# EAGLE design k60 (EAGLE 9.6.2)
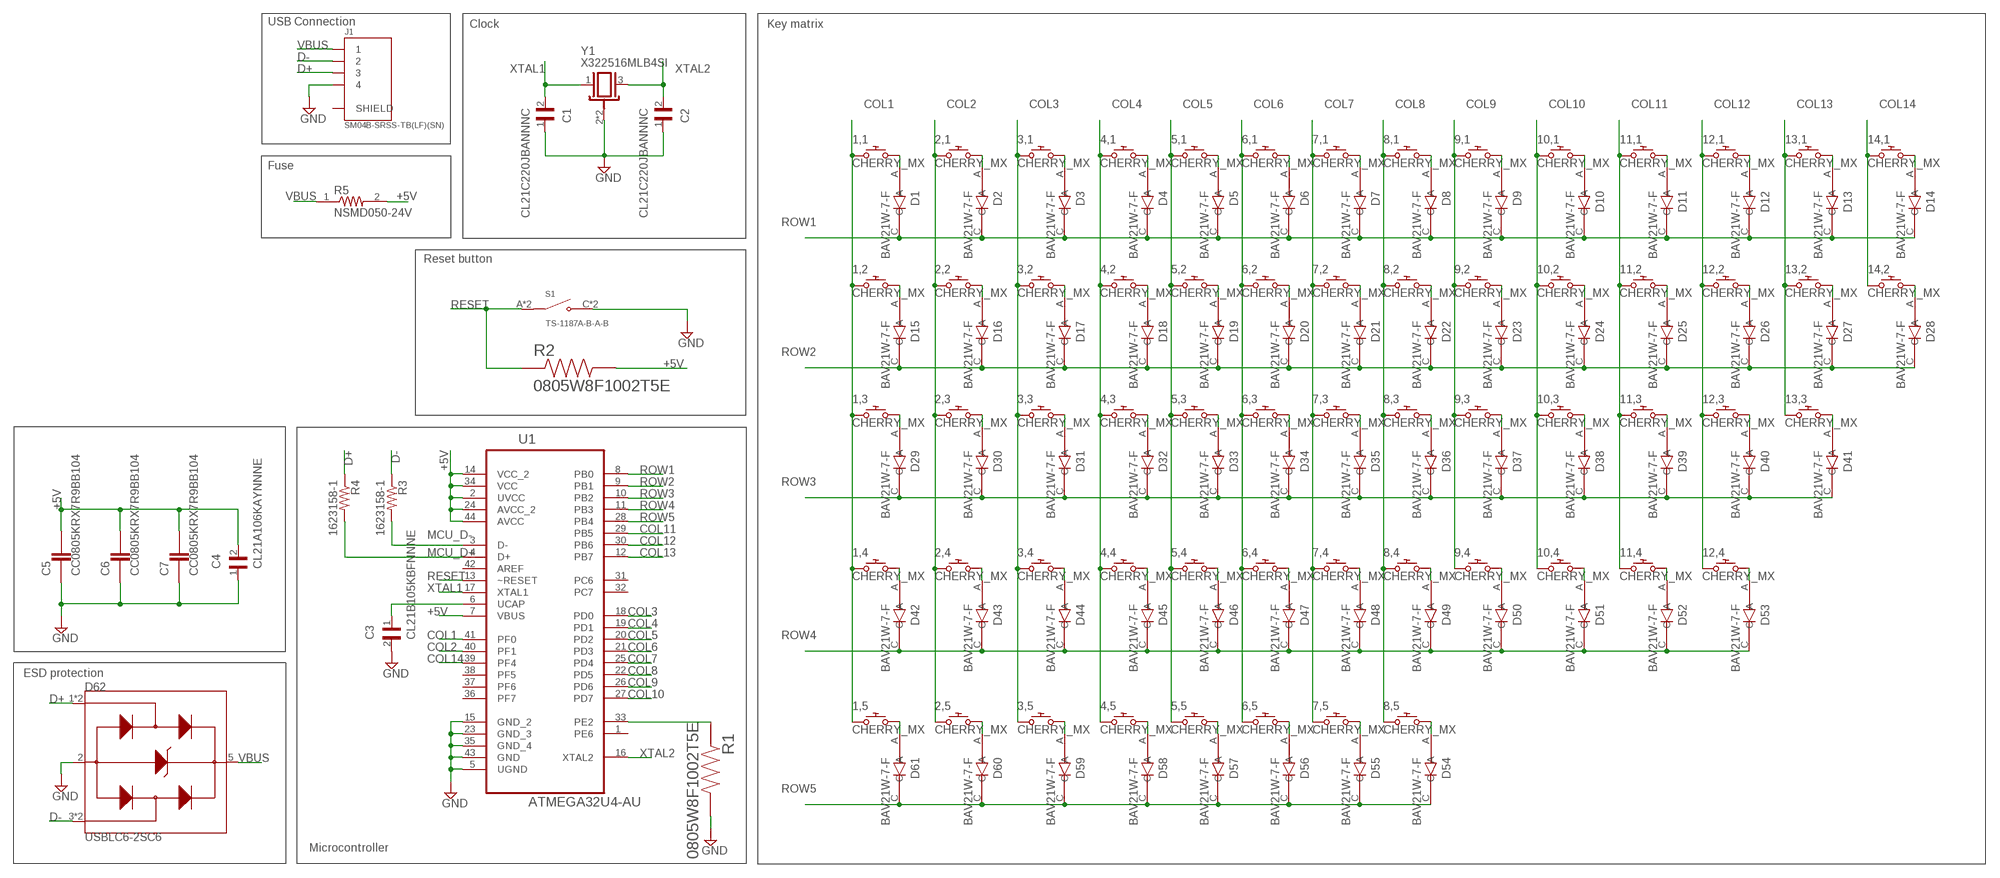
[diagram p0: schematic, sheet 1]

## Parts
1,1  CHERRY_MX  [CHERRY_MX]
1,2  CHERRY_MX  [CHERRY_MX]
1,3  CHERRY_MX  [CHERRY_MX]
1,4  CHERRY_MX  [CHERRY_MX]
1,5  CHERRY_MX  [CHERRY_MX]
2,1  CHERRY_MX  [CHERRY_MX]
2,2  CHERRY_MX  [CHERRY_MX]
2,3  CHERRY_MX  [CHERRY_MX]
2,4  CHERRY_MX  [CHERRY_MX]
2,5  CHERRY_MX  [CHERRY_MX]
3,1  CHERRY_MX  [CHERRY_MX]
3,2  CHERRY_MX  [CHERRY_MX]
3,3  CHERRY_MX  [CHERRY_MX]
3,4  CHERRY_MX  [CHERRY_MX]
3,5  CHERRY_MX  [CHERRY_MX]
4,1  CHERRY_MX  [CHERRY_MX]
4,2  CHERRY_MX  [CHERRY_MX]
4,3  CHERRY_MX  [CHERRY_MX]
4,4  CHERRY_MX  [CHERRY_MX]
4,5  CHERRY_MX  [CHERRY_MX]
5,1  CHERRY_MX  [CHERRY_MX]
5,2  CHERRY_MX  [CHERRY_MX]
5,3  CHERRY_MX  [CHERRY_MX]
5,4  CHERRY_MX  [CHERRY_MX]
5,5  CHERRY_MX  [CHERRY_MX]
6,1  CHERRY_MX  [CHERRY_MX]
6,2  CHERRY_MX  [CHERRY_MX]
6,3  CHERRY_MX  [CHERRY_MX]
6,4  CHERRY_MX  [CHERRY_MX]
6,5  CHERRY_MX  [CHERRY_MX]
7,1  CHERRY_MX  [CHERRY_MX]
7,2  CHERRY_MX  [CHERRY_MX]
7,3  CHERRY_MX  [CHERRY_MX]
7,4  CHERRY_MX  [CHERRY_MX]
7,5  CHERRY_MX  [CHERRY_MX]
8,1  CHERRY_MX  [CHERRY_MX]
8,2  CHERRY_MX  [CHERRY_MX]
8,3  CHERRY_MX  [CHERRY_MX]
8,4  CHERRY_MX  [CHERRY_MX]
8,5  CHERRY_MX  [CHERRY_MX]
9,1  CHERRY_MX  [CHERRY_MX]
9,2  CHERRY_MX  [CHERRY_MX]
9,3  CHERRY_MX  [CHERRY_MX]
9,4  CHERRY_MX  [CHERRY_MX]
10,1  CHERRY_MX  [CHERRY_MX]
10,2  CHERRY_MX  [CHERRY_MX]
10,3  CHERRY_MX  [CHERRY_MX]
10,4  CHERRY_MX  [CHERRY_MX]
11,1  CHERRY_MX  [CHERRY_MX]
11,2  CHERRY_MX  [CHERRY_MX]
11,3  CHERRY_MX  [CHERRY_MX]
11,4  CHERRY_MX  [CHERRY_MX]
12,1  CHERRY_MX  [CHERRY_MX]
12,2  CHERRY_MX  [CHERRY_MX]
12,3  CHERRY_MX  [CHERRY_MX]
12,4  CHERRY_MX  [CHERRY_MX]
13,1  CHERRY_MX  [CHERRY_MX]
13,2  CHERRY_MX  [CHERRY_MX]
13,3  CHERRY_MX  [CHERRY_MX]
14,1  CHERRY_MX  [CHERRY_MX]
14,2  CHERRY_MX  [CHERRY_MX]
C1  CL21C220JBANNNC  [CAPC2012X140N]
C2  CL21C220JBANNNC  [CAPC2012X140N]
C3  CL21B105KBFNNNE  [CL21B105KBFNNNE_CAPC2012X140N]
C4  CL21A106KAYNNNE  [CAPC2012X135N]
C5  CC0805KRX7R9BB104  [CAPC2012X70]
C6  CC0805KRX7R9BB104  [CAPC2012X70]
C7  CC0805KRX7R9BB104  [CAPC2012X70]
D1  BAV21W-7-F  [SOD3715X135N]
D2  BAV21W-7-F  [SOD3715X135N]
D3  BAV21W-7-F  [SOD3715X135N]
D4  BAV21W-7-F  [SOD3715X135N]
D5  BAV21W-7-F  [SOD3715X135N]
D6  BAV21W-7-F  [SOD3715X135N]
D7  BAV21W-7-F  [SOD3715X135N]
D8  BAV21W-7-F  [SOD3715X135N]
D9  BAV21W-7-F  [SOD3715X135N]
D10  BAV21W-7-F  [SOD3715X135N]
D11  BAV21W-7-F  [SOD3715X135N]
D12  BAV21W-7-F  [SOD3715X135N]
D13  BAV21W-7-F  [SOD3715X135N]
D14  BAV21W-7-F  [SOD3715X135N]
D15  BAV21W-7-F  [SOD3715X135N]
D16  BAV21W-7-F  [SOD3715X135N]
D17  BAV21W-7-F  [SOD3715X135N]
D18  BAV21W-7-F  [SOD3715X135N]
D19  BAV21W-7-F  [SOD3715X135N]
D20  BAV21W-7-F  [SOD3715X135N]
D21  BAV21W-7-F  [SOD3715X135N]
D22  BAV21W-7-F  [SOD3715X135N]
D23  BAV21W-7-F  [SOD3715X135N]
D24  BAV21W-7-F  [SOD3715X135N]
D25  BAV21W-7-F  [SOD3715X135N]
D26  BAV21W-7-F  [SOD3715X135N]
D27  BAV21W-7-F  [SOD3715X135N]
D28  BAV21W-7-F  [SOD3715X135N]
D29  BAV21W-7-F  [SOD3715X135N]
D30  BAV21W-7-F  [SOD3715X135N]
D31  BAV21W-7-F  [SOD3715X135N]
D32  BAV21W-7-F  [SOD3715X135N]
D33  BAV21W-7-F  [SOD3715X135N]
D34  BAV21W-7-F  [SOD3715X135N]
D35  BAV21W-7-F  [SOD3715X135N]
D36  BAV21W-7-F  [SOD3715X135N]
D37  BAV21W-7-F  [SOD3715X135N]
D38  BAV21W-7-F  [SOD3715X135N]
D39  BAV21W-7-F  [SOD3715X135N]
D40  BAV21W-7-F  [SOD3715X135N]
D41  BAV21W-7-F  [SOD3715X135N]
D42  BAV21W-7-F  [SOD3715X135N]
D43  BAV21W-7-F  [SOD3715X135N]
D44  BAV21W-7-F  [SOD3715X135N]
D45  BAV21W-7-F  [SOD3715X135N]
D46  BAV21W-7-F  [SOD3715X135N]
D47  BAV21W-7-F  [SOD3715X135N]
D48  BAV21W-7-F  [SOD3715X135N]
D49  BAV21W-7-F  [SOD3715X135N]
D50  BAV21W-7-F  [SOD3715X135N]
D51  BAV21W-7-F  [SOD3715X135N]
D52  BAV21W-7-F  [SOD3715X135N]
D53  BAV21W-7-F  [SOD3715X135N]
D54  BAV21W-7-F  [SOD3715X135N]
D55  BAV21W-7-F  [SOD3715X135N]
D56  BAV21W-7-F  [SOD3715X135N]
D57  BAV21W-7-F  [SOD3715X135N]
D58  BAV21W-7-F  [SOD3715X135N]
D59  BAV21W-7-F  [SOD3715X135N]
D60  BAV21W-7-F  [SOD3715X135N]
D61  BAV21W-7-F  [SOD3715X135N]
D62  USBLC6-2SC6  [SOT95P280X145-6N]
J1  SM04B-SRSS-TB(LF)(SN)  [JST_SM04B-SRSS-TB(LF)(SN)]
R1  0805W8F1002T5E  [RESC2012X60N]
R2  0805W8F1002T5E  [RESC2012X60N]
R3  1623158-1  [RESC2012X65N]
R4  1623158-1  [RESC2012X65N]
R5  NSMD050-24V  [RESC3115X65N]
S1  TS-1187A-B-A-B  [SW_TS-1187A-B-A-B]
U1  ATMEGA32U4-AU  [QFP80P1200X1200X120-44N]
Y1  X322516MLB4SI  [OSC_X322516MLB4SI]

## Nets
+5V: C4.2 C5.2 C6.2 C7.2 R2.2 R5.2 U1.2(UVCC) U1.7(VBUS) U1.14(VCC_2) U1.24(AVCC_2) U1.34(VCC) U1.44(AVCC)
COL1: 1,1.S1 1,2.S1 1,3.S1 1,4.S1 1,5.S1 U1.41(PF0)
COL2: 2,1.S1 2,2.S1 2,3.S1 2,4.S1 2,5.S1 U1.40(PF1)
COL3: 3,1.S1 3,2.S1 3,3.S1 3,4.S1 3,5.S1 U1.18(PD0)
COL4: 4,1.S1 4,2.S1 4,3.S1 4,4.S1 4,5.S1 U1.19(PD1)
COL5: 5,1.S1 5,2.S1 5,3.S1 5,4.S1 5,5.S1 U1.20(PD2)
COL6: 6,1.S1 6,2.S1 6,3.S1 6,4.S1 6,5.S1 U1.21(PD3)
COL7: 7,1.S1 7,2.S1 7,3.S1 7,4.S1 7,5.S1 U1.25(PD4)
COL8: 8,1.S1 8,2.S1 8,3.S1 8,4.S1 8,5.S1 U1.22(PD5)
COL9: 9,1.S1 9,2.S1 9,3.S1 9,4.S1 U1.26(PD6)
COL10: 10,1.S1 10,2.S1 10,3.S1 10,4.S1 U1.27(PD7)
COL11: 11,1.S1 11,2.S1 11,3.S1 11,4.S1 U1.29(PB5)
COL12: 12,1.S1 12,2.S1 12,3.S1 12,4.S1 U1.30(PB6)
COL13: 13,1.S1 13,2.S1 13,3.S1 U1.12(PB7)
COL14: 14,1.S1 14,2.S1 U1.39(PF4)
D+: D62.1(I/O1) D62.6(I/O1) J1.3 R4.1
D-: D62.3(I/O2) D62.4(I/O2) J1.2 R3.1
GND: C1.1 C2.1 C3.2 C4.1 C5.1 C6.1 C7.1 D62.2(GND) J1.4 R1.2 S1.C(NO) S1.D(NO) U1.5(UGND) U1.15(GND_2) U1.23(GND_3) U1.35(GND_4) U1.43(GND) Y1.2(GND) Y1.4(GND)
MCU_D+: R4.2 U1.4(D+)
MCU_D-: R3.2 U1.3(D-)
N$3: C3.1 U1.6(UCAP)
N$4: R1.1 U1.33(PE2)
N$15: 1,1.S2 D1.A
N$16: 2,1.S2 D2.A
N$17: 3,1.S2 D3.A
N$18: 4,1.S2 D4.A
N$19: 5,1.S2 D5.A
N$20: 6,1.S2 D6.A
N$21: 7,1.S2 D7.A
N$22: 8,1.S2 D8.A
N$23: 9,1.S2 D9.A
N$24: 10,1.S2 D10.A
N$25: 11,1.S2 D11.A
N$26: 12,1.S2 D12.A
N$27: 13,1.S2 D13.A
N$28: 14,1.S2 D14.A
N$29: 1,2.S2 D15.A
N$30: 2,2.S2 D16.A
N$31: 3,2.S2 D17.A
N$32: 4,2.S2 D18.A
N$33: 5,2.S2 D19.A
N$34: 6,2.S2 D20.A
N$35: 7,2.S2 D21.A
N$36: 8,2.S2 D22.A
N$37: 9,2.S2 D23.A
N$38: 10,2.S2 D24.A
N$39: 11,2.S2 D25.A
N$40: 12,2.S2 D26.A
N$41: 13,2.S2 D27.A
N$42: 1,3.S2 D29.A
N$43: 2,3.S2 D30.A
N$44: 3,3.S2 D31.A
N$45: 4,3.S2 D32.A
N$46: 5,3.S2 D33.A
N$47: 6,3.S2 D34.A
N$48: 7,3.S2 D35.A
N$49: 8,3.S2 D36.A
N$50: 9,3.S2 D37.A
N$51: 10,3.S2 D38.A
N$52: 11,3.S2 D39.A
N$53: 12,3.S2 D40.A
N$54: 13,3.S2 D41.A
N$55: 14,2.S2 D28.A
N$56: 1,4.S2 D42.A
N$57: 2,4.S2 D43.A
N$58: 3,4.S2 D44.A
N$59: 4,4.S2 D45.A
N$60: 5,4.S2 D46.A
N$61: 6,4.S2 D47.A
N$62: 7,4.S2 D48.A
N$63: 8,4.S2 D49.A
N$64: 9,4.S2 D50.A
N$65: 10,4.S2 D51.A
N$66: 11,4.S2 D52.A
N$67: 12,4.S2 D53.A
N$69: 1,5.S2 D61.A
N$70: 2,5.S2 D60.A
N$71: 3,5.S2 D59.A
N$72: 4,5.S2 D58.A
N$73: 5,5.S2 D57.A
N$74: 6,5.S2 D56.A
N$75: 7,5.S2 D55.A
N$76: 8,5.S2 D54.A
RESET: R2.1 S1.A(COM) S1.B(COM) U1.13(~RESET)
ROW1: D1.C D2.C D3.C D4.C D5.C D6.C D7.C D8.C D9.C D10.C D11.C D12.C D13.C D14.C U1.8(PB0)
ROW2: D15.C D16.C D17.C D18.C D19.C D20.C D21.C D22.C D23.C D24.C D25.C D26.C D27.C D28.C U1.9(PB1)
ROW3: D29.C D30.C D31.C D32.C D33.C D34.C D35.C D36.C D37.C D38.C D39.C D40.C D41.C U1.10(PB2)
ROW4: D42.C D43.C D44.C D45.C D46.C D47.C D48.C D49.C D50.C D51.C D52.C D53.C U1.11(PB3)
ROW5: D54.C D55.C D56.C D57.C D58.C D59.C D60.C D61.C U1.28(PB4)
VBUS: D62.5(VBUS) J1.1 R5.1
XTAL1: C1.2 U1.17(XTAL1) Y1.1
XTAL2: C2.2 U1.16(XTAL2) Y1.3
Unconnected: J1.S1(SHIELD) J1.S2(SHIELD) U1.1(PE6) U1.31(PC6) U1.32(PC7) U1.36(PF7) U1.37(PF6) U1.38(PF5) U1.42(AREF)

## Notes on the sheet
- USB Connection | Clock | Key matrix
- Fuse
- Reset button
- ESD protection
- Microcontroller

## Library data of the parts
1,1-1,5 2,1-2,5 3,1-3,5 4,1-4,5 5,1-5,5 6,1-6,5 7,1-7,5 8,1-8,5 9,1-9,4 10,1-10,4 11,1-11,4 12,1-12,4 13,1-13,3 14,1 14,2 = cherry:CHERRY_MX: Cherry keymodule MX; FARNELL: 2292961; MOUSER: 540-MX1A-11NW
C1 C2 = k60:CL21C220JBANNNC: KC 22pF 0805 5% 50V NP0; LCSC_PART#: C1804
C3 = k60:CL21B105KBFNNNE: Capacitor: ceramic; MLCC; 1uF; 50V; X7R; ±10%; SMD; 0805; LCSC_PART#: C28323
C4 = k60:CL21A106KAYNNNE: Cap Ceramic 10uF 25V X5R 10% SMD 0805 85°C Embossed T/R; LCSC_PART#: C15850
C5-C7 = k60:CC0805KRX7R9BB104: 0805 0.1 uF 50 V ±10 % Tolerance X7R SMT Multilayer Ceramic Capacitor; LCSC_PART#: C49678; MANUFACTURER: YAGEO
D1-D61 = k60:BAV21W-7-F: SURFACE MOUNT SWITCHING DIODE; LCSC_PART#: C81598; MANUFACTURER: Diodes Inc.
D62 = k60:USBLC6-2SC6: 17V Clamp 5A (8/20µs) Ipp Tvs Diode Surface Mount SOT-23-6; MANUFACTURER: STMicroelectronics; MAXIMUM_PACKAGE_HEIGHT: 1.45mm; PARTREV: 5; STANDARD: IPC-7351B
J1 = k60:SM04B-SRSS-TB(LF)(SN): SH Series 1.0 mm Pitch 2 Position Single Row Side Entry Shrouded Header; LCSC_PART#: C160404; MANUFACTURER: JST; STANDARD: Manufacturer recommendations
R1 R2 = k60:0805W8F1002T5E: Chip Resistor - Surface Mount 10KOhms ±1% 1/8W 0805 RoHS; LCSC_PART#: C17414
R3 R4 = k60:1623158-1: CRG0805 1% 22R; LCSC_PART#: C17561
R5 = k60:NSMD050-24V: PTC Resettable Fuses 1206 RoHS; LCSC_PART#: C70076
S1 = k60:TS-1187A-B-A-B: SPST 50mA @ 12VDC Top Actuated Round Button 160gf SMD Tactile Switches RoHS; LCSC_PART#: C318884; MANUFACTURER: XKB Industrial Precision; MAXIMUM_PACKAGE_HEIGHT: 1.5mm; PARTREV: A0; STANDARD: Manufacturer Recommendations
U1 = k60:ATMEGA32U4-AU: 8-bit Microcontroller with ISP Flash and USB Controller; LCSC_PART#: C44854; MPN: ATMEGA32U4-AU; OC_FARNELL: 1748525; OC_NEWARK: 26R5633; PACKAGE: TQFP-44; SUPPLIER: Atmel
Y1 = k60:X322516MLB4SI: External dimensions: 3.2 x 2.5 x 0.8 mm. Frequency range: 11.0592MHz ~54MHz; LCSC_PART#: C13738; MANUFACTURER: YXC; MAXIMUM_PACKAGE_HEIGHT: 0.8 mm; PARTREV: N/A; STANDARD: Manufacturer Recommendations

## Module MATRIX
Ports: N$1(io) N$2(io) N$3(io) N$4(io) N$5(io) ROW1(io) ROW2(io) ROW3(io) ROW4(io) ROW5(io)
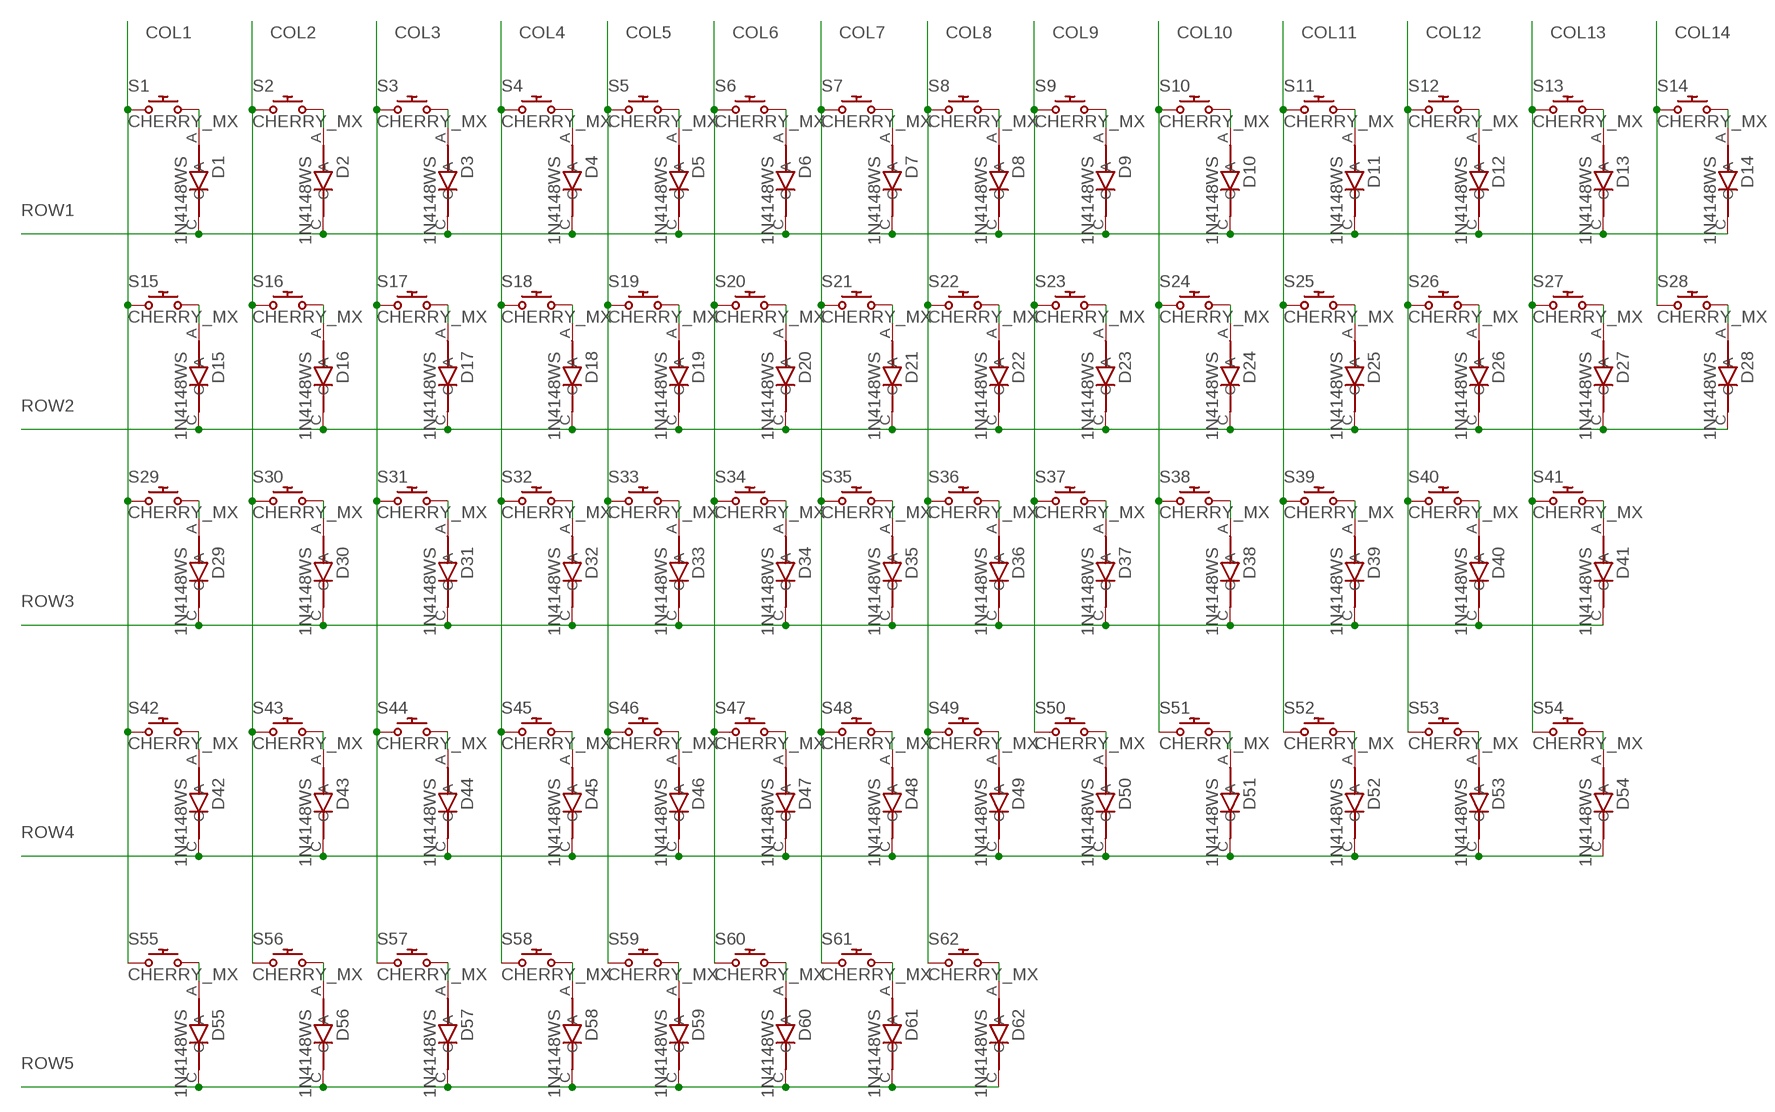
[diagram p1: schematic, module MATRIX, sheet 1]

### Parts
D1  1N4148WS  [SODFL2512X100N]
D2  1N4148WS  [SODFL2512X100N]
D3  1N4148WS  [SODFL2512X100N]
D4  1N4148WS  [SODFL2512X100N]
D5  1N4148WS  [SODFL2512X100N]
D6  1N4148WS  [SODFL2512X100N]
D7  1N4148WS  [SODFL2512X100N]
D8  1N4148WS  [SODFL2512X100N]
D9  1N4148WS  [SODFL2512X100N]
D10  1N4148WS  [SODFL2512X100N]
D11  1N4148WS  [SODFL2512X100N]
D12  1N4148WS  [SODFL2512X100N]
D13  1N4148WS  [SODFL2512X100N]
D14  1N4148WS  [SODFL2512X100N]
D15  1N4148WS  [SODFL2512X100N]
D16  1N4148WS  [SODFL2512X100N]
D17  1N4148WS  [SODFL2512X100N]
D18  1N4148WS  [SODFL2512X100N]
D19  1N4148WS  [SODFL2512X100N]
D20  1N4148WS  [SODFL2512X100N]
D21  1N4148WS  [SODFL2512X100N]
D22  1N4148WS  [SODFL2512X100N]
D23  1N4148WS  [SODFL2512X100N]
D24  1N4148WS  [SODFL2512X100N]
D25  1N4148WS  [SODFL2512X100N]
D26  1N4148WS  [SODFL2512X100N]
D27  1N4148WS  [SODFL2512X100N]
D28  1N4148WS  [SODFL2512X100N]
D29  1N4148WS  [SODFL2512X100N]
D30  1N4148WS  [SODFL2512X100N]
D31  1N4148WS  [SODFL2512X100N]
D32  1N4148WS  [SODFL2512X100N]
D33  1N4148WS  [SODFL2512X100N]
D34  1N4148WS  [SODFL2512X100N]
D35  1N4148WS  [SODFL2512X100N]
D36  1N4148WS  [SODFL2512X100N]
D37  1N4148WS  [SODFL2512X100N]
D38  1N4148WS  [SODFL2512X100N]
D39  1N4148WS  [SODFL2512X100N]
D40  1N4148WS  [SODFL2512X100N]
D41  1N4148WS  [SODFL2512X100N]
D42  1N4148WS  [SODFL2512X100N]
D43  1N4148WS  [SODFL2512X100N]
D44  1N4148WS  [SODFL2512X100N]
D45  1N4148WS  [SODFL2512X100N]
D46  1N4148WS  [SODFL2512X100N]
D47  1N4148WS  [SODFL2512X100N]
D48  1N4148WS  [SODFL2512X100N]
D49  1N4148WS  [SODFL2512X100N]
D50  1N4148WS  [SODFL2512X100N]
D51  1N4148WS  [SODFL2512X100N]
D52  1N4148WS  [SODFL2512X100N]
D53  1N4148WS  [SODFL2512X100N]
D54  1N4148WS  [SODFL2512X100N]
D55  1N4148WS  [SODFL2512X100N]
D56  1N4148WS  [SODFL2512X100N]
D57  1N4148WS  [SODFL2512X100N]
D58  1N4148WS  [SODFL2512X100N]
D59  1N4148WS  [SODFL2512X100N]
D60  1N4148WS  [SODFL2512X100N]
D61  1N4148WS  [SODFL2512X100N]
D62  1N4148WS  [SODFL2512X100N]
S1  CHERRY_MX  [CHERRY_MX]
S2  CHERRY_MX  [CHERRY_MX]
S3  CHERRY_MX  [CHERRY_MX]
S4  CHERRY_MX  [CHERRY_MX]
S5  CHERRY_MX  [CHERRY_MX]
S6  CHERRY_MX  [CHERRY_MX]
S7  CHERRY_MX  [CHERRY_MX]
S8  CHERRY_MX  [CHERRY_MX]
S9  CHERRY_MX  [CHERRY_MX]
S10  CHERRY_MX  [CHERRY_MX]
S11  CHERRY_MX  [CHERRY_MX]
S12  CHERRY_MX  [CHERRY_MX]
S13  CHERRY_MX  [CHERRY_MX]
S14  CHERRY_MX  [CHERRY_MX]
S15  CHERRY_MX  [CHERRY_MX]
S16  CHERRY_MX  [CHERRY_MX]
S17  CHERRY_MX  [CHERRY_MX]
S18  CHERRY_MX  [CHERRY_MX]
S19  CHERRY_MX  [CHERRY_MX]
S20  CHERRY_MX  [CHERRY_MX]
S21  CHERRY_MX  [CHERRY_MX]
S22  CHERRY_MX  [CHERRY_MX]
S23  CHERRY_MX  [CHERRY_MX]
S24  CHERRY_MX  [CHERRY_MX]
S25  CHERRY_MX  [CHERRY_MX]
S26  CHERRY_MX  [CHERRY_MX]
S27  CHERRY_MX  [CHERRY_MX]
S28  CHERRY_MX  [CHERRY_MX]
S29  CHERRY_MX  [CHERRY_MX]
S30  CHERRY_MX  [CHERRY_MX]
S31  CHERRY_MX  [CHERRY_MX]
S32  CHERRY_MX  [CHERRY_MX]
S33  CHERRY_MX  [CHERRY_MX]
S34  CHERRY_MX  [CHERRY_MX]
S35  CHERRY_MX  [CHERRY_MX]
S36  CHERRY_MX  [CHERRY_MX]
S37  CHERRY_MX  [CHERRY_MX]
S38  CHERRY_MX  [CHERRY_MX]
S39  CHERRY_MX  [CHERRY_MX]
S40  CHERRY_MX  [CHERRY_MX]
S41  CHERRY_MX  [CHERRY_MX]
S42  CHERRY_MX  [CHERRY_MX]
S43  CHERRY_MX  [CHERRY_MX]
S44  CHERRY_MX  [CHERRY_MX]
S45  CHERRY_MX  [CHERRY_MX]
S46  CHERRY_MX  [CHERRY_MX]
S47  CHERRY_MX  [CHERRY_MX]
S48  CHERRY_MX  [CHERRY_MX]
S49  CHERRY_MX  [CHERRY_MX]
S50  CHERRY_MX  [CHERRY_MX]
S51  CHERRY_MX  [CHERRY_MX]
S52  CHERRY_MX  [CHERRY_MX]
S53  CHERRY_MX  [CHERRY_MX]
S54  CHERRY_MX  [CHERRY_MX]
S55  CHERRY_MX  [CHERRY_MX]
S56  CHERRY_MX  [CHERRY_MX]
S57  CHERRY_MX  [CHERRY_MX]
S58  CHERRY_MX  [CHERRY_MX]
S59  CHERRY_MX  [CHERRY_MX]
S60  CHERRY_MX  [CHERRY_MX]
S61  CHERRY_MX  [CHERRY_MX]
S62  CHERRY_MX  [CHERRY_MX]

### Nets
COL1: S1.S1 S15.S1 S29.S1 S42.S1 S55.S1
COL2: S2.S1 S16.S1 S30.S1 S43.S1 S56.S1
COL3: S3.S1 S17.S1 S31.S1 S44.S1 S57.S1
COL4: S4.S1 S18.S1 S32.S1 S45.S1 S58.S1
COL5: S5.S1 S19.S1 S33.S1 S46.S1 S59.S1
COL6: S6.S1 S20.S1 S34.S1 S47.S1 S60.S1
COL7: S7.S1 S21.S1 S35.S1 S48.S1 S61.S1
COL8: S8.S1 S22.S1 S36.S1 S49.S1 S62.S1
COL9: S9.S1 S23.S1 S37.S1 S50.S1
COL10: S10.S1 S24.S1 S38.S1 S51.S1
COL11: S11.S1 S25.S1 S39.S1 S52.S1
COL12: S12.S1 S26.S1 S40.S1 S53.S1
COL13: S13.S1 S27.S1 S41.S1 S54.S1
COL14: S14.S1 S28.S1
N$15: D1.A S1.S2
N$16: D2.A S2.S2
N$17: D3.A S3.S2
N$18: D4.A S4.S2
N$19: D5.A S5.S2
N$20: D6.A S6.S2
N$21: D7.A S7.S2
N$22: D8.A S8.S2
N$23: D9.A S9.S2
N$24: D10.A S10.S2
N$25: D11.A S11.S2
N$26: D12.A S12.S2
N$27: D13.A S13.S2
N$28: D14.A S14.S2
N$29: D15.A S15.S2
N$30: D16.A S16.S2
N$31: D17.A S17.S2
N$32: D18.A S18.S2
N$33: D19.A S19.S2
N$34: D20.A S20.S2
N$35: D21.A S21.S2
N$36: D22.A S22.S2
N$37: D23.A S23.S2
N$38: D24.A S24.S2
N$39: D25.A S25.S2
N$40: D26.A S26.S2
N$41: D27.A S27.S2
N$42: D29.A S29.S2
N$43: D30.A S30.S2
N$44: D31.A S31.S2
N$45: D32.A S32.S2
N$46: D33.A S33.S2
N$47: D34.A S34.S2
N$48: D35.A S35.S2
N$49: D36.A S36.S2
N$50: D37.A S37.S2
N$51: D38.A S38.S2
N$52: D39.A S39.S2
N$53: D40.A S40.S2
N$54: D41.A S41.S2
N$55: D28.A S28.S2
N$56: D42.A S42.S2
N$57: D43.A S43.S2
N$58: D44.A S44.S2
N$59: D45.A S45.S2
N$60: D46.A S46.S2
N$61: D47.A S47.S2
N$62: D48.A S48.S2
N$63: D49.A S49.S2
N$64: D50.A S50.S2
N$65: D51.A S51.S2
N$66: D52.A S52.S2
N$67: D53.A S53.S2
N$68: D54.A S54.S2
N$69: D55.A S55.S2
N$70: D56.A S56.S2
N$71: D57.A S57.S2
N$72: D58.A S58.S2
N$73: D59.A S59.S2
N$74: D60.A S60.S2
N$75: D61.A S61.S2
N$76: D62.A S62.S2
ROW1: D1.C D2.C D3.C D4.C D5.C D6.C D7.C D8.C D9.C D10.C D11.C D12.C D13.C D14.C
ROW2: D15.C D16.C D17.C D18.C D19.C D20.C D21.C D22.C D23.C D24.C D25.C D26.C D27.C D28.C
ROW3: D29.C D30.C D31.C D32.C D33.C D34.C D35.C D36.C D37.C D38.C D39.C D40.C D41.C
ROW4: D42.C D43.C D44.C D45.C D46.C D47.C D48.C D49.C D50.C D51.C D52.C D53.C D54.C
ROW5: D55.C D56.C D57.C D58.C D59.C D60.C D61.C D62.C

### Library data of the parts
D1-D62 = SnapEDA-Library:1N4148WS: 1N4148WS Series 75 V 300 mA Surface Mount Small Signal Diodes - SOD-323F; MANUFACTURER: Fairchild Semiconductor
S1-S62 = cherry:CHERRY_MX: Cherry keymodule MX; FARNELL: 2292961; MOUSER: 540-MX1A-11NW

## Board
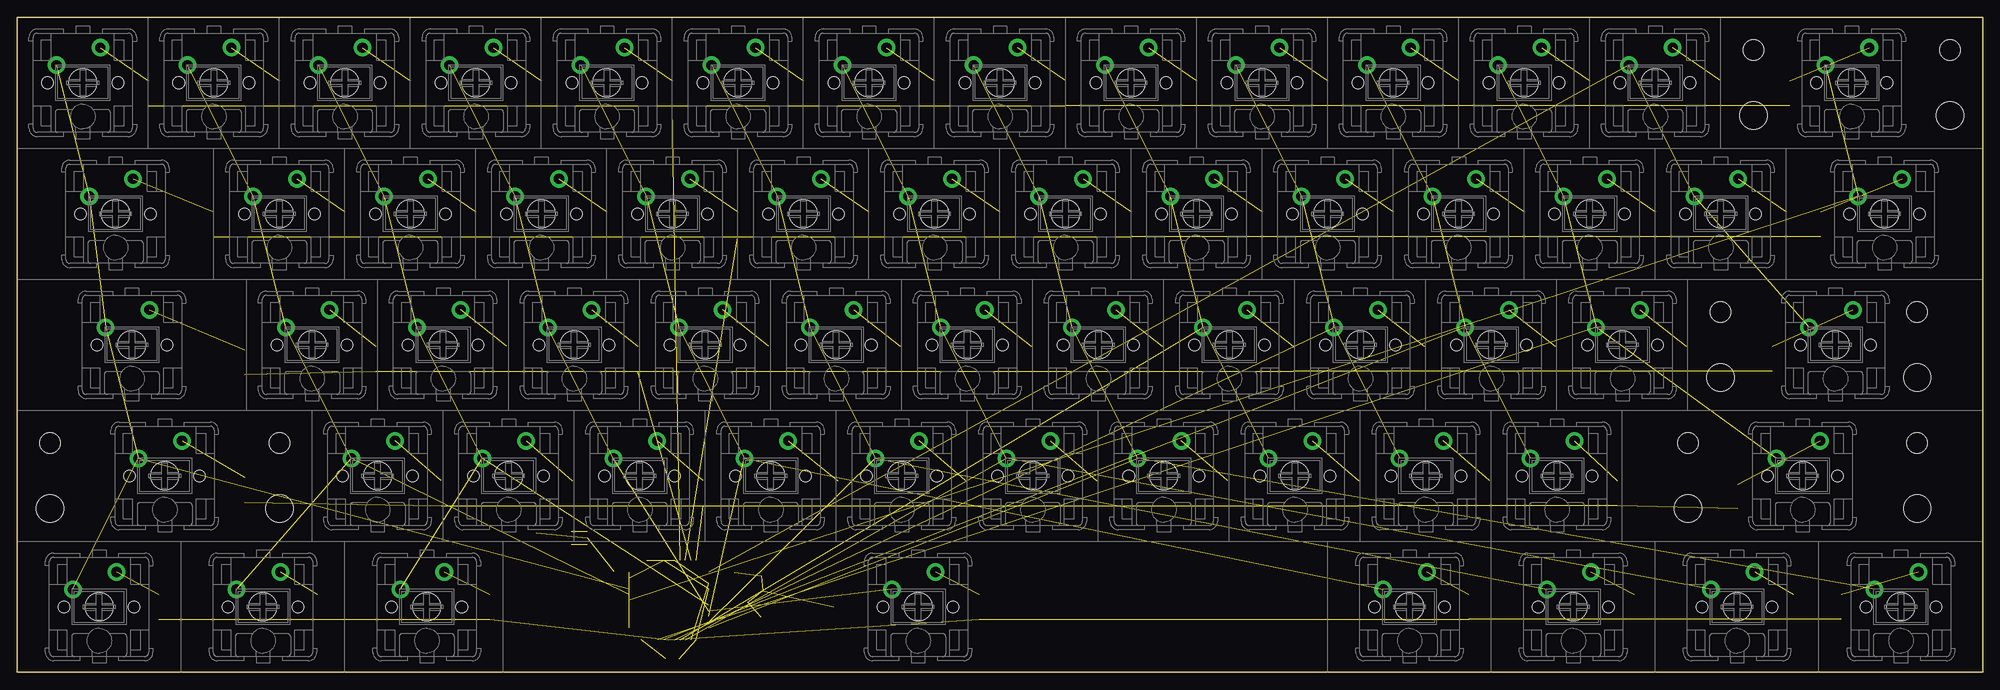
[diagram p2: board, top side]
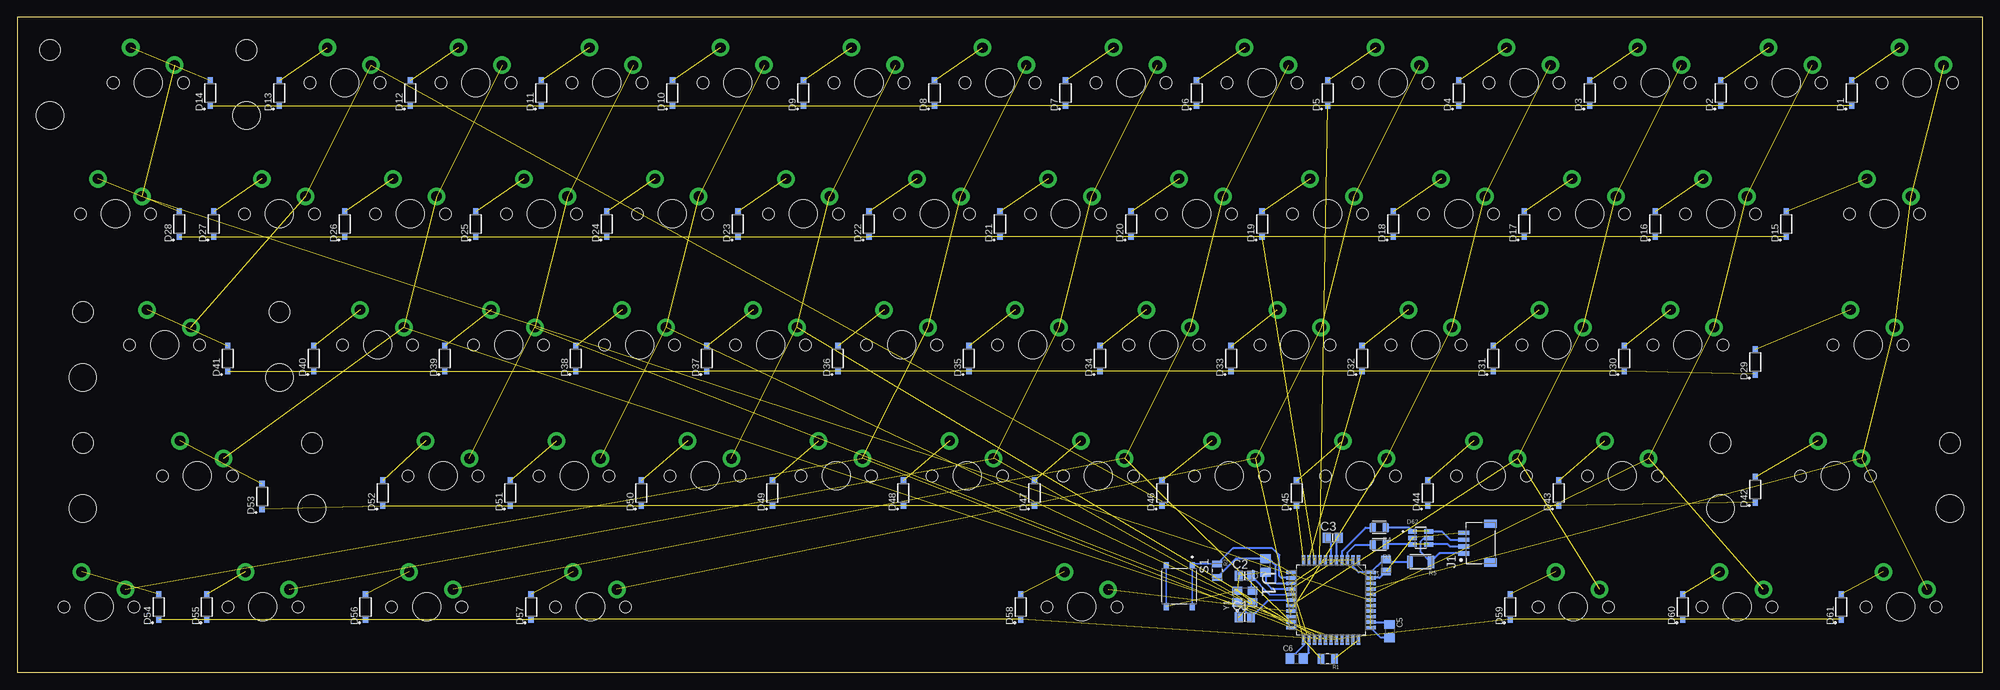
[diagram p3: board, bottom side, seen from below]

Size 285 x 95 mm. Coordinates in mm from the lower left corner, seen from the top.
Outline: 0,95 285,95 285,0 0,0 0,95
Copper layers (1*16): Top 0.035mm / dielectric 1.5mm / Bottom 0.035mm
Design rules "default": minimum track width 6mil, minimum drill 0.35mm, track to track 6mil, track to pad 6mil, pad to pad 6mil, via to via 6mil, smd to smd 6mil, copper to edge 40mil, drill to drill 6mil, minimum pad ring 10mil, minimum via ring 8mil, stop-mask expansion 4mil, vias tented up to drill 0mil, thermal gap 10mil
Holes 3 mm at 4.75,33.25 38,33.25 242.25,33.25 275.5,33.25 247,52.25 275.5,52.25 251.75,90.25 280.25,90.25
Holes 4 mm at 4.75,23.75 38,23.75 242.25,23.75 275.5,23.75 247,42.75 275.5,42.75 251.75,80.75 280.25,80.75

### Footprints (pad centres in the part's own frame; a part is rotated, then mirrored left to right if it is on the bottom)
CHERRY_MX = drill 1.5 pad 2.54: S1 -3.81,2.54; S2 2.54,5.08 | hole 1.7: -5.08,0; 5.08,0 | hole 4.1: 0,0
CAPC2012X140N = smd 1.15 x 1.45: 1 -0.9,0; 2 0.9,0
CL21B105KBFNNNE_CAPC2012X140N = smd 1.15 x 1.45: 1 -0.9,0; 2 0.9,0
CAPC2012X135N = smd 1.1 x 1.38: 1 -0.863,0; 2 0.863,0
CAPC2012X70 = smd 1.3 x 1.5: 1 -0.95,0; 2 0.95,0
SOD3715X135N = smd 1 x 0.75: A 1.8,0; C -1.8,0
SOT95P280X145-6N = smd 1.36 x 0.6: 1 -1.175,0.95; 2 -1.175,0; 3 -1.175,-0.95; 4 1.175,-0.95; 5 1.175,0; 6 1.175,0.95
JST_SM04B-SRSS-TB(LF)(SN) = smd 0.6 x 1.55: 1 -1.5,0; 2 -0.5,0; 3 0.5,0; 4 1.5,0 | smd 1.2 x 1.8: S1 -2.8,-3.875; S2 2.8,-3.875
RESC2012X60N = smd 0.96 x 1.47: 1 -0.978,0; 2 0.978,0
RESC2012X65N = smd 1 x 1.42: 1 -0.935,0; 2 0.935,0
RESC3115X65N = smd 1.09 x 1.77: 1 -1.465,0 | smd 0.94 x 1.77: 2 1.54,0
SW_TS-1187A-B-A-B = smd 1 x 0.75: A -3,1.875; B 3,1.875; C -3,-1.875; D 3,-1.875
QFP80P1200X1200X120-44N = smd 1.473 x 0.508: 1 -5.74,3.988; 2 -5.74,3.2; 3 -5.74,2.388; 4 -5.74,1.6; 5 -5.74,0.787; 6 -5.74,0; 7 -5.74,-0.787; 8 -5.74,-1.6; 9 -5.74,-2.388; 10 -5.74,-3.2; 11 -5.74,-3.988; 23 5.74,-3.988; 24 5.74,-3.2; 25 5.74,-2.388; 26 5.74,-1.6; 27 5.74,-0.787; 28 5.74,0; 29 5.74,0.787; 30 5.74,1.6; 31 5.74,2.388; 32 5.74,3.2; 33 5.74,3.988 | smd 0.508 x 1.473: 12 -3.988,-5.74; 13 -3.2,-5.74; 14 -2.388,-5.74; 15 -1.6,-5.74; 16 -0.787,-5.74; 17 0,-5.74; 18 0.787,-5.74; 19 1.6,-5.74; 20 2.388,-5.74; 21 3.2,-5.74; 22 3.988,-5.74; 34 3.988,5.74; 35 3.2,5.74; 36 2.388,5.74; 37 1.6,5.74; 38 0.787,5.74; 39 0,5.74; 40 -0.787,5.74; 41 -1.6,5.74; 42 -2.388,5.74; 43 -3.2,5.74; 44 -3.988,5.74
OSC_X322516MLB4SI = smd 1.2 x 1.4: 1 -0.85,1.1; 2 -0.85,-1.1; 3 0.85,-1.1; 4 0.85,1.1

### Placement (x,y rotation side)
1,1  9.5,85.5 0 top
1,2  14.25,66.5 0 top
1,3  16.62,47.5 0 top
1,4  21.38,28.5 0 top
1,5  11.88,9.5 0 top
2,1  28.5,85.5 0 top
2,2  38,66.5 0 top
2,3  42.75,47.5 0 top
2,4  52.25,28.5 0 top
2,5  35.62,9.5 0 top
3,1  47.5,85.5 0 top
3,2  57,66.5 0 top
3,3  61.75,47.5 0 top
3,4  71.25,28.5 0 top
3,5  59.38,9.5 0 top
4,1  66.5,85.5 0 top
4,2  76,66.5 0 top
4,3  80.75,47.5 0 top
4,4  90.25,28.5 0 top
4,5  130.62,9.5 0 top
5,1  85.5,85.5 0 top
5,2  95,66.5 0 top
5,3  99.75,47.5 0 top
5,4  109.25,28.5 0 top
5,5  201.88,9.5 0 top
6,1  104.5,85.5 0 top
6,2  114,66.5 0 top
6,3  118.75,47.5 0 top
6,4  128.25,28.5 0 top
6,5  225.62,9.5 0 top
7,1  123.5,85.5 0 top
7,2  133,66.5 0 top
7,3  137.75,47.5 0 top
7,4  147.25,28.5 0 top
7,5  249.38,9.5 0 top
8,1  142.5,85.5 0 top
8,2  152,66.5 0 top
8,3  156.75,47.5 0 top
8,4  166.25,28.5 0 top
8,5  273.12,9.5 0 top
9,1  161.5,85.5 0 top
9,2  171,66.5 0 top
9,3  175.75,47.5 0 top
9,4  185.25,28.5 0 top
10,1  180.5,85.5 0 top
10,2  190,66.5 0 top
10,3  194.75,47.5 0 top
10,4  204.25,28.5 0 top
11,1  199.5,85.5 0 top
11,2  209,66.5 0 top
11,3  213.75,47.5 0 top
11,4  223.25,28.5 0 top
12,1  218.5,85.5 0 top
12,2  228,66.5 0 top
12,3  232.75,47.5 0 top
12,4  258.88,28.5 0 top
13,1  237.5,85.5 0 top
13,2  247,66.5 0 top
13,3  263.62,47.5 0 top
14,1  266,85.5 0 top
14,2  270.75,66.5 0 top
C1  107,8 0 bottom
C2  107,14 0 bottom
C3  94.25,19.5 0 bottom
C4  86.5,15.5 90 bottom
C5  86,6 270 bottom
C6  99.5,2 0 bottom
C7  104,15.5 90 bottom
D1  19,84 90 bottom
D2  38,84 90 bottom
D3  57,84 90 bottom
D4  76,84 90 bottom
D5  95,84 90 bottom
D6  114,84 90 bottom
D7  133,84 90 bottom
D8  152,84 90 bottom
D9  171,84 90 bottom
D10  190,84 90 bottom
D11  209,84 90 bottom
D12  228,84 90 bottom
D13  247,84 90 bottom
D14  257,84 90 bottom
D15  28.5,65 90 bottom
D16  47.5,65 90 bottom
D17  66.5,65 90 bottom
D18  85.5,65 90 bottom
D19  104.5,65 90 bottom
D20  123.5,65 90 bottom
D21  142.5,65 90 bottom
D22  161.5,65 90 bottom
D23  180.5,65 90 bottom
D24  199.5,65 90 bottom
D25  218.5,65 90 bottom
D26  237.5,65 90 bottom
D27  256.5,65 90 bottom
D28  261.5,65 90 bottom
D29  33,45 90 bottom
D30  52,45.5 90 bottom
D31  71,45.5 90 bottom
D32  90,45.5 90 bottom
D33  109,45.5 90 bottom
D34  128,45.5 90 bottom
D35  147,45.5 90 bottom
D36  166,45.5 90 bottom
D37  185,45.5 90 bottom
D38  204,45.5 90 bottom
D39  223,45.5 90 bottom
D40  242,45.5 90 bottom
D41  254.5,45.5 90 bottom
D42  33,26.5 90 bottom
D43  61.5,26 90 bottom
D44  80.5,26 90 bottom
D45  99.5,26 90 bottom
D46  119,26 90 bottom
D47  137.5,26 90 bottom
D48  156.5,26 90 bottom
D49  175.5,26 90 bottom
D50  194.5,26 90 bottom
D51  213.5,26 90 bottom
D52  232,26 90 bottom
D53  249.5,25.5 90 bottom
D54  264.5,9.5 90 bottom
D55  257.5,9.5 90 bottom
D56  234.5,9.5 90 bottom
D57  210.5,9.5 90 bottom
D58  139.5,9.5 90 bottom
D59  68.5,9.5 90 bottom
D60  43.5,9.5 90 bottom
D61  20.5,9.5 90 bottom
D62  81.5,19.5 0 bottom
J1  75.25,18.75 90 bottom
R1  95,2 180 bottom
R2  111,14.75 270 bottom
R3  87.5,18.5 180 bottom
R4  87.5,21 180 bottom
R5  81.5,16 180 bottom
S1  116.5,12.5 270 bottom
U1  94.5,10.5 270 bottom
Y1  107,11 90 bottom

### Tracks (layer width: path | path; a pad name or v marks a point on that pad's centre or on a via)
+5V  (4 unrouted)
  Bottom 0.305: U1.2 91.3,15.3 90.49,14.49 U1.44 86.88,16.36 C4.2 86.14,16 R5.2 | C5.2 87.3,5.05 U1.34 | C6.2 97.7,2.85 U1.24 | U1.14 102.39,12.89 102.5,13 102.5,15.5 103.45,16.45 C7.2 108.32,16.45 R2.2
COL1  (5 unrouted)
COL2  (5 unrouted)
COL3  (5 unrouted)
COL4  (5 unrouted)
COL5  (5 unrouted)
COL6  (5 unrouted)
COL7  (5 unrouted)
COL8  (5 unrouted)
COL9  (4 unrouted)
COL10  (4 unrouted)
COL11  (4 unrouted)
COL12  (4 unrouted)
COL13  (3 unrouted)
COL14  (2 unrouted)
D+  (1 unrouted)
  Bottom 0.254: D62.6 78.45,20.45 77.25,19.25 J1.3
  Bottom 0.305: D62.1 83.22,21 R4.1
D-  (1 unrouted)
  Bottom 0.254: J1.2 77.25,18.25 77.55,18.55 D62.4
  Bottom 0.305: D62.3 86.52,18.55 R3.1
GND  (12 unrouted)
  Bottom 0.25: S1.D S1.C
  Bottom 0.305: C4.1 87.44,13.7 U1.43 | U1.35 86.35,7.3 C5.1 | C6.1 98.49,3.96 U1.23 | C7.1 104,13 103.1,12.1 U1.15 | C3.2 93.71,19.14 U1.5
MCU_D+
  Bottom 0.254: U1.4 92.9,17.6 89.5,21 R4.2
MCU_D-
  Bottom 0.254: U1.3 92.11,17.39 91,18.5 R3.2
N$3
  Bottom 0.305: U1.6 94.5,18.85 C3.1
N$4  (1 unrouted)
N$15  (1 unrouted)
N$16  (1 unrouted)
N$17  (1 unrouted)
N$18  (1 unrouted)
N$19  (1 unrouted)
N$20  (1 unrouted)
N$21  (1 unrouted)
N$22  (1 unrouted)
N$23  (1 unrouted)
N$24  (1 unrouted)
N$25  (1 unrouted)
N$26  (1 unrouted)
N$27  (1 unrouted)
N$28  (1 unrouted)
N$29  (1 unrouted)
N$30  (1 unrouted)
N$31  (1 unrouted)
N$32  (1 unrouted)
N$33  (1 unrouted)
N$34  (1 unrouted)
N$35  (1 unrouted)
N$36  (1 unrouted)
N$37  (1 unrouted)
N$38  (1 unrouted)
N$39  (1 unrouted)
N$40  (1 unrouted)
N$41  (1 unrouted)
N$42  (1 unrouted)
N$43  (1 unrouted)
N$44  (1 unrouted)
N$45  (1 unrouted)
N$46  (1 unrouted)
N$47  (1 unrouted)
N$48  (1 unrouted)
N$49  (1 unrouted)
N$50  (1 unrouted)
N$51  (1 unrouted)
N$52  (1 unrouted)
N$53  (1 unrouted)
N$54  (1 unrouted)
N$55  (1 unrouted)
N$56  (1 unrouted)
N$57  (1 unrouted)
N$58  (1 unrouted)
N$59  (1 unrouted)
N$60  (1 unrouted)
N$61  (1 unrouted)
N$62  (1 unrouted)
N$63  (1 unrouted)
N$64  (1 unrouted)
N$65  (1 unrouted)
N$66  (1 unrouted)
N$67  (1 unrouted)
N$69  (1 unrouted)
N$70  (1 unrouted)
N$71  (1 unrouted)
N$72  (1 unrouted)
N$73  (1 unrouted)
N$74  (1 unrouted)
N$75  (1 unrouted)
N$76  (1 unrouted)
RESET
  Bottom 0.25: R2.1 114.4,15.73 S1.A S1.B
  Bottom 0.254: U1.13 101.7,13.7 102,14 102,17 103,18 108.73,18 R2.1
ROW1  (14 unrouted)
ROW2  (14 unrouted)
ROW3  (13 unrouted)
ROW4  (12 unrouted)
ROW5  (8 unrouted)
VBUS
  Bottom 0.305: J1.1 78.78,17.25 R5.1 81.5,17.46 81.5,19 81,19.5 D62.5
XTAL1
  Bottom 0.25: Y1.1 108.1,10 C1.2 103.6,10.5 U1.17
XTAL2
  Bottom 0.25: Y1.3 106.1,12.05 C2.2 103.39,11.29 U1.16